# Altium project edison_breakout.PrjPcb
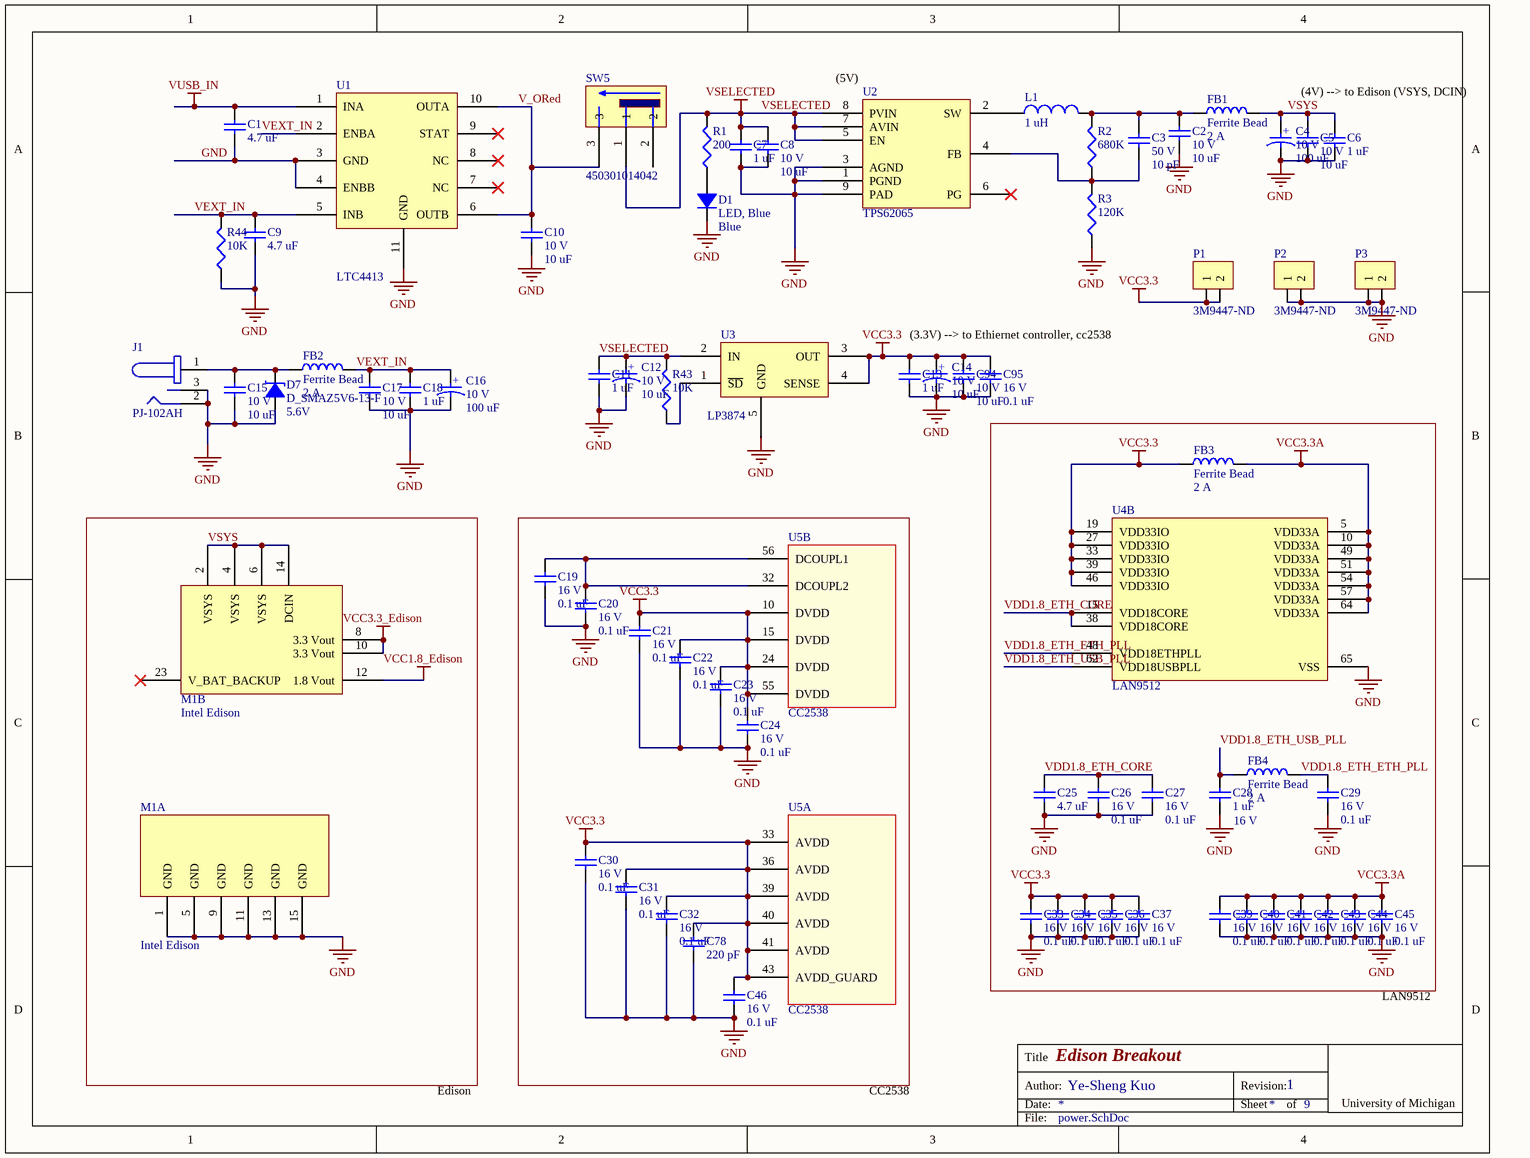
[diagram p0: power.SchDoc]
6 sheets, 162 parts. Net scope: flat (ports and power ports of the same name join across sheets).
Board files: edison_breakout3.PcbDoc, edison_breakoutarray.PcbDoc
Sheets:
  power.SchDoc
  cc2538.SchDoc
  ethernet.SchDoc
  usb_host_slave.SchDoc
  cc2520_cc2592.SchDoc
  edison_misc.SchDoc

## Sheet power.SchDoc: Edison Breakout
size Letter; Author: Ye-Sheng Kuo; Revision: 1; SheetTotal: 9

### Parts
C1  value 4.7 uF  [0603]  (hidden comment: Ceramic capacitor)
C2  value 10 uF  voltage rated: 10 V  [0603]  (hidden comment: Ceramic capacitor)
C3  value 10 pF  voltage rated: 50 V  [0402]  (hidden comment: Ceramic capacitor)
C4  value 100 uF  voltage rated: 10 V  [1206 - POLAR MARKING]  (hidden comment: Tantalum capacitor)
C5  value 10 uF  voltage rated: 10 V  [0603]  (hidden comment: Ceramic capacitor)
C6  value 1 uF  [0402]  (hidden comment: Ceramic capacitor)
C7  value 1 uF  [0402]  (hidden comment: Ceramic capacitor)
C8  value 10 uF  voltage rated: 10 V  [0603]  (hidden comment: Ceramic capacitor)
C9  value 4.7 uF  [0603]  (hidden comment: Ceramic capacitor)
C10  value 10 uF  voltage rated: 10 V  [0603]  (hidden comment: Ceramic capacitor)
C11  value 1 uF  [0402]  (hidden comment: Ceramic capacitor)
C12  value 10 uF  voltage rated: 10 V  [0603 - Polar Marking]  (hidden comment: Tantalum capacitor)
C13  value 1 uF  [0402]  (hidden comment: Ceramic capacitor)
C14  value 10 uF  voltage rated: 10 V  [0603 - Polar Marking]  (hidden comment: Tantalum capacitor)
C15  value 10 uF  voltage rated: 10 V  [0603]  (hidden comment: Ceramic capacitor)
C16  value 100 uF  voltage rated: 10 V  [1206 - POLAR MARKING]  (hidden comment: Tantalum capacitor)
C17  value 10 uF  voltage rated: 10 V  [0603]  (hidden comment: Ceramic capacitor)
C18  value 1 uF  [0402]  (hidden comment: Ceramic capacitor)
C19  value 0.1 uF  voltage rated: 16 V  [0402]  (hidden comment: Ceramic capacitor)
C20  value 0.1 uF  voltage rated: 16 V  [0402]  (hidden comment: Ceramic capacitor)
C21  value 0.1 uF  voltage rated: 16 V  [0402]  (hidden comment: Ceramic capacitor)
C22  value 0.1 uF  voltage rated: 16 V  [0402]  (hidden comment: Ceramic capacitor)
C23  value 0.1 uF  voltage rated: 16 V  [0402]  (hidden comment: Ceramic capacitor)
C24  value 0.1 uF  voltage rated: 16 V  [0402]  (hidden comment: Ceramic capacitor)
C25  value 4.7 uF  [0603]  (hidden comment: Ceramic capacitor)
C26  value 0.1 uF  voltage rated: 16 V  [0402]  (hidden comment: Ceramic capacitor)
C27  value 0.1 uF  voltage rated: 16 V  [0402]  (hidden comment: Ceramic capacitor)
C28  value 1 uF  voltage rated: 16 V  [0402]  (hidden comment: Ceramic capacitor)
C29  value 0.1 uF  voltage rated: 16 V  [0402]  (hidden comment: Ceramic capacitor)
C30  value 0.1 uF  voltage rated: 16 V  [0402]  (hidden comment: Ceramic capacitor)
C31  value 0.1 uF  voltage rated: 16 V  [0402]  (hidden comment: Ceramic capacitor)
C32  value 0.1 uF  voltage rated: 16 V  [0402]  (hidden comment: Ceramic capacitor)
C33  value 0.1 uF  voltage rated: 16 V  [0402]  (hidden comment: Ceramic capacitor)
C34  value 0.1 uF  voltage rated: 16 V  [0402]  (hidden comment: Ceramic capacitor)
C35  value 0.1 uF  voltage rated: 16 V  [0402]  (hidden comment: Ceramic capacitor)
C36  value 0.1 uF  voltage rated: 16 V  [0402]  (hidden comment: Ceramic capacitor)
C37  value 0.1 uF  voltage rated: 16 V  [0402]  (hidden comment: Ceramic capacitor)
C39  value 0.1 uF  voltage rated: 16 V  [0402]  (hidden comment: Ceramic capacitor)
C40  value 0.1 uF  voltage rated: 16 V  [0402]  (hidden comment: Ceramic capacitor)
C41  value 0.1 uF  voltage rated: 16 V  [0402]  (hidden comment: Ceramic capacitor)
C42  value 0.1 uF  voltage rated: 16 V  [0402]  (hidden comment: Ceramic capacitor)
C43  value 0.1 uF  voltage rated: 16 V  [0402]  (hidden comment: Ceramic capacitor)
C44  value 0.1 uF  voltage rated: 16 V  [0402]  (hidden comment: Ceramic capacitor)
C45  value 0.1 uF  voltage rated: 16 V  [0402]  (hidden comment: Ceramic capacitor)
C46  value 0.1 uF  voltage rated: 16 V  [0402]  (hidden comment: Ceramic capacitor)
C78  value 220 pF  [0402]  (hidden comment: Ceramic capacitor)
C94  value 10 uF  voltage rated: 10 V  [0603]  (hidden comment: Ceramic capacitor)
C95  value 0.1 uF  voltage rated: 16 V  [0402]  (hidden comment: Ceramic capacitor)
D1  LED, Blue  Color: Blue  [0402 - DIODE]
D7  D_SMAZ5V6-13-F  Zf: 5.6V  [SMAZ5V1]
FB1  Ferrite Bead  current rating: 2 A  [0603]
FB2  Ferrite Bead  current rating: 2 A  [0603]
FB3  Ferrite Bead  current rating: 2 A  [0603]
FB4  Ferrite Bead  current rating: 2 A  [0603]
J1  PJ-102AH  [PJ-102AH]
L1  value 1 uH  [1210]  (hidden comment: Chip inductor)
M1  Intel Edison  [Intel Edison mating]  (parts A,B of 5)
P1  Supplier Part Number 1: 3M9447-ND  [1x2 header]  (hidden comment: 1 x 2 header)
P2  Supplier Part Number 1: 3M9447-ND  [1x2 header]  (hidden comment: 1 x 2 header)
P3  Supplier Part Number 1: 3M9447-ND  [1x2 header]  (hidden comment: 1 x 2 header)
R1  value 200  [0402]  (hidden comment: Chip resistor)
R2  value 680K  [0402]  (hidden comment: Chip resistor)
R3  value 120K  [0402]  (hidden comment: Chip resistor)
R43  value 10K  [0402]  (hidden comment: Chip resistor)
R44  value 10K  [0402]  (hidden comment: Chip resistor)
SW5  450301014042  [450301014042]
U1  LTC4413  [DFN-10]
U2  TPS62065  [PWSON-8]
U3  LP3874  [SOT150P700X180-5N]
U4  LAN9512  [QFN-64]  (part B of 5)
U5  CC2538  [QFN56]  (parts A,B of 6)

### Nets
GND: C1.2 C2.2 C4.2 C5.2 C6.2 C7.2 C8.2 C9.2 C10.2 C11.2 C12.2 C13.2 C14.2 C15.2 C16.2 C17.2 C18.2 C19.2 C20.2 C21.2 C22.2 C23.2 C24.2 C25.2 C26.2 C27.2 C28.2 C29.2 C30.2 C31.2 C32.2 C33.2 C34.2 C35.2 C36.2 C37.2 C39.2 C40.2 C41.2 C42.2 C43.2 C44.2 C45.2 C46.2 C78.2 C94.2 C95.2 D1.2 D7.1 J1.2 J1.3 M1.1(GND) M1.5(GND) M1.9(GND) M1.11(GND) M1.13(GND) M1.15(GND) P2.1 P2.2 P3.1 P3.2 R3.2 R44.2 U1.3(GND) U1.4(ENBB) U1.11(GND) U2.1(PGND) U2.3(AGND) U2.9(PAD) U3.5(GND) U4.65(VSS)
VCC1.8_Edison: M1.12(1.8_Vout)
VCC3.3: C13.1 C14.1 C21.1 C22.1 C23.1 C24.1 C30.1 C31.1 C32.1 C33.1 C34.1 C35.1 C36.1 C37.1 C46.1 C78.1 C94.1 C95.1 FB3.2 P1.1 P1.2 U3.3(OUT) U3.4(SENSE) U4.19(VDD33IO) U4.27(VDD33IO) U4.33(VDD33IO) U4.39(VDD33IO) U4.46(VDD33IO) U5.10(DVDD) U5.15(DVDD) U5.24(DVDD) U5.33(AVDD) U5.36(AVDD) U5.39(AVDD) U5.40(AVDD) U5.41(AVDD) U5.43(AVDD_GUARD) U5.55(DVDD)
VCC3.3_Edison: M1.8(3.3_Vout) M1.10(3.3_Vout)
VCC3.3A: C39.1 C40.1 C41.1 C42.1 C43.1 C44.1 C45.1 FB3.1 U4.5(VDD33A) U4.10(VDD33A) U4.49(VDD33A) U4.51(VDD33A) U4.54(VDD33A) U4.57(VDD33A) U4.64(VDD33A)
VSELECTED: C7.1 C8.1 C11.1 C12.1 R1.1 R43.1 SW5.1 U2.5(EN) U2.7(AVIN) U2.8(PVIN) U3.2(IN)
VUSB_IN: C1.1 U1.1(INA)
V_ORed: C10.1 SW5.3 U1.6(OUTB) U1.10(OUTA)
VDD1.8_ETH_CORE: C25.1 C26.1 C27.1 U4.15(VDD18CORE) U4.38(VDD18CORE)
VDD1.8_ETH_ETH_PLL: C29.1 FB4.1 U4.48(VDD18ETHPLL)
VDD1.8_ETH_USB_PLL: C28.1 FB4.2 U4.62(VDD18USBPLL)
VEXT_IN: C9.1 C16.1 C17.1 C18.1 FB2.1 R44.1 U1.2(ENBA) U1.5(INB)
VSYS: C4.1 C5.1 C6.1 FB1.1 M1.2(VSYS) M1.4(VSYS) M1.6(VSYS) M1.14(DCIN)
NetC2_1: C2.1 C3.1 FB1.2 L1.1 R2.1
NetC3_2: C3.2 R2.2 R3.1 U2.4(FB)
NetC15_1: C15.1 D7.2 FB2.2 J1.1
NetC19_1: C19.1 C20.1 U5.32(DCOUPL2) U5.56(DCOUPL1)
NetD1_1: D1.1 R1.2
NetL1_2: L1.2 U2.2(SW)
NetR43_2: R43.2 U3.1(~{SD})

Not connected (* = marked no-connect by the designer): M1 23(V_BAT_BACKUP)*; SW5 2; U1 7(NC)* 8(NC)* 9(STAT)*; U2 6(PG)*

### Notes on the sheet
- (near U2) (5V)
- (4V) --> to Edison (VSYS, DCIN)
- (3.3V) --> to Ethiernet controller, cc2538
- LAN9512
- Edison
- CC2538
- Title
- Date:
- Author:
- Revision:
- Sheet
- of
- University of Michigan
- File:
- (in symbol C_10u_10V_0603_tantalum) +
- (in symbol C_100u_10V_1206_tantalum) +

### Library data of the parts
C1 C9 C25 = C_4.7u_10V_0603_ceramic: Ceramic capacitor, 4.7u, 10V, 0603 package; Manufacture: TDK; tolerance: 20%; Temp rating: X5R; package: 0603; voltage rated: 10 V; Supplier 1: Digi-Key; Supplier Part Number 1: 445-7482-1-ND
C2 C5 C8 C10 C15 C17 C94 = C_10u_10V_0603_ceramic: Ceramic capacitor, 10 uF, 10 V, 0603 package; Manufacture: Murata; tolerance: 20%; Temperature Coefficient: X5R; package: 0603; Supplier 1: Digi-Key; Supplier Part Number 1: 490-7197-1-ND
C3 = C_10p_50V_0402_ceramic: Ceramic capacitor, 10 pF, 16 V, 0402 package; Manufacture: Murata; tolerance: 1%; Temperature Coefficient: C0G; package: 0402; Supplier 1: Digi-Key; Supplier Part Number 1: 490-6186-1-ND
C4 C16 = C_100u_10V_1206_tantalum: Tantalum capacitor, 100 uF, 10 V, 1206 package; Manufacture: AVX; tolerance: 20%; package: 1206; Supplier 1: Digi-Key; Supplier Part Number 1: 478-6251-1-ND
C6 C7 C11 C13 C18 C28 = C_1u_16V_0402_ceramic: Ceramic capacitor, 1 uF, 16V, 0402 package; Manufacture: TDK; tolerance: 10%; Temperature rating: X5R; package: 0402; Supplier 1: Digi-Key; Supplier Part Number 1: 445-4978-1-ND
  C6 C7 C11 C13 C18: voltage rated: 16 V
C12 C14 = C_10u_10V_0603_tantalum: Tantalum capacitor, 10 uF, 10 V, 0603 package; Manufacture: Rohm Semiconductor; tolerance: 10%; ESR: 9 Ω; package: 0603; Supplier 1: Digi-Key; Supplier Part Number 1: 511-1679-1-ND
C19-C24 C26 C27 C29-C37 C39-C46 C95 = C_0.1u_16V_0402_ceramic: Ceramic capacitor, 0.1u, 16 V, 0402 package; Manufacture: Murata; tolerance: 10%; Temperature Coef: X7R; package: 0402; Supplier 1: Digi-Key; Supplier Part Number 1: 490-3261-1-ND
C78 = C_220p_50V_0402_ceramic: Ceramic capacitor, 220 pF, 0402 package; Manufacture: Johanson; voltage rated: 50 V; tolerance: 10%; package: 0402; Temperature: X7R; Supplier 1: Digi-Key; Supplier Part Number 1: 445-1254-1-ND
D1 = D_LED_BLUE_0402: LED, Blue, 0402; Forward Voltage: 2.9 V; Current @ VF: 5 mA; package: 0402; Supplier 1: Digi-Key; Supplier Part Number 1: 511-1615-1-ND
D7 = D_SMAZ5V6-13-F: SURFACE MOUNT ZENER DIODE; Supplier 1: Digi-Key; Supplier Part Number 1: SMAZ5V6-FDICT-ND
FB1-FB4 = FB_2A_0603: Ferrite Bead, 2 A, 0603 package; DC resistance: 50 m; package: 0603; Supplier 1: Digi-Key; Supplier Part Number 1: 553-2387-1-ND
J1 = PJ-102AH: CONN PWR JACK 2.1X5.5MM HIGH CUR; Supplier 1: Digi-Key; Supplier Part Number 1: CP-102AH-ND
L1 = L_1u_LQM32PN: Chip inductor, 1 uH, 1210 package, LQM32PN; tolerance: 20%; package: 1210; Supplier 1: Digi-Key; Supplier Part Number 1: 490-10767-1-ND
P1-P3 = 1 x 2 header: 100 mils standard header; Supplier 1: Digi-Key
R1 = R_200_0402: Chip resistor, 200, 0402 package; tolerance: 1%; power: 1/16 W; package: 0402; Supplier 1: Digi-Key; Supplier Part Number 1: 541-200LCT-ND
R2 = R_680K_0402: Chip resistor, 680K, 0402 package; tolerance: 1%; power: 1/16 W; package: 0402; Supplier 1: Digi-Key; Supplier Part Number 1: 541-680KLCT-ND
R3 = R_120K_0402: Chip resistor, 120K, 0402 package; tolerance: 1%; power: 1/16 W; package: 0402; Supplier 1: Digi-Key; Supplier Part Number 1: 541-120KLCT-ND
R43 R44 = R_10K_0402: Chip resistor, 10K, 0402 package; tolerance: 1%; power: 1/16 W; package: 0402; Supplier 1: Digi-Key; Supplier Part Number 1: 541-10.0KLCT-ND
SW5 = 450301014042: Slide switch, SPDT, 500 mA, 12 V; Supplier 1: Digi-Key; Supplier Part Number 1: 450301014042-ND
U1 = LTC4413: Dual 2.6A, 2.5V to 5.5V,  Ideal Diodes in 3mm × 3mm DFN; Supplier 1: Digi-Key; Supplier Part Number 1: LTC4413EDD#TRPBFCT-ND
U2 = TPS62065: 3-MHz, 2-A, Step-Down Converter; Supplier 1: Digi-Key; Supplier Part Number 1: 296-27204-1-ND
U3 = LP3874: LP387x 0.8-A Fast Ultra-Low-Dropout Linear Regulators; Supplier 1: Digi-Key; Supplier Part Number 1: LP3874EMP-3.3/NOPBCT-ND
U4 = LAN9512: USB 2.0 Hub and 10/100  Ethernet Controller; Supplier 1: Digi-Key; Supplier Part Number 1: 638-1086-ND
U5 = CC2538: A Powerful System-On-Chip for 2.4-GHz IEEE 802.15.4, 6LoWPAN  and ZigBee Applications; Supplier 1: Digi-Key; Supplier Part Number 1: 296-35797-1-ND

## Sheet cc2538.SchDoc: Edison Breakout
size Letter; Author: Ye-Sheng Kuo; Revision: 1; SheetTotal: 9
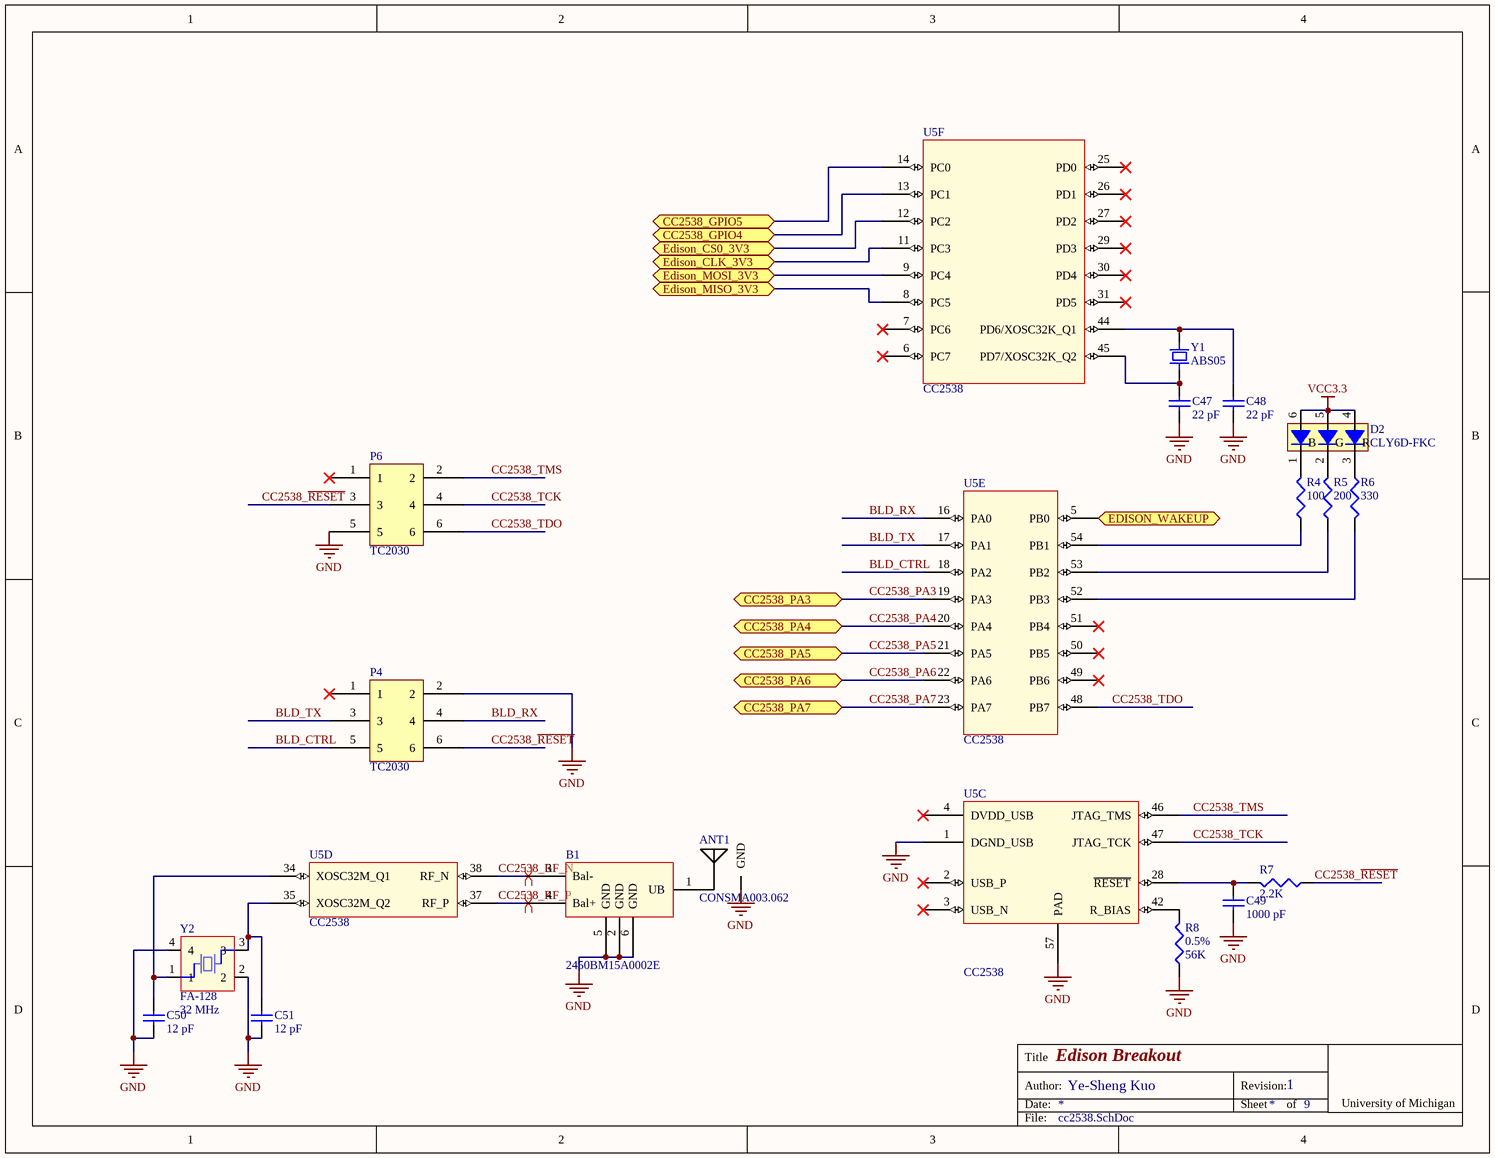
[diagram p1: cc2538.SchDoc]

### Parts
ANT1  CONSMA003.062  [CONSMA003.062]
B1  2450BM15A0002E  [2450BM15A0002]
C47  value 22 pF  [0402]  (hidden comment: Ceramic capacitor)
C48  value 22 pF  [0402]  (hidden comment: Ceramic capacitor)
C49  value 1000 pF  [0402]  (hidden comment: Ceramic capacitor)
C50  value 12 pF  [0402]  (hidden comment: Ceramic capacitor)
C51  value 12 pF  [0402]  (hidden comment: Ceramic capacitor)
D2  CLY6D-FKC  [PLCC6]
P4  TC2030  [TC2030-IDC-NLFP]
P6  TC2030  [TC2030-IDC-NLFP]
R4  value 100  [0402]  (hidden comment: Chip resistor)
R5  value 200  [0402]  (hidden comment: Chip resistor)
R6  value 330  [0402]  (hidden comment: Chip resistor)
R7  value 2.2K  [0402]  (hidden comment: Chip resistor)
R8  value 56K  tolerance: 0.5%  [0402]  (hidden comment: Chip resistor)
U5  CC2538  [QFN56]  (parts C,D,E,F of 6)
Y1  ABS05  [ABS05]
Y2  FA-128  frequency: 32 MHz  [FA-128]

### Ports
CC2538_GPIO4, CC2538_GPIO5, CC2538_PA3, CC2538_PA4, CC2538_PA5, CC2538_PA6, CC2538_PA7, Edison_CLK_3V3, Edison_CS0_3V3, Edison_MISO_3V3, Edison_MOSI_3V3, EDISON_WAKEUP

### Nets
GND: ANT1.1(GND) B1.2(GND) B1.5(GND) B1.6(GND) C47.2 C48.2 C49.2 C50.1 C51.1 P4.2 P6.5 R8.2 U5.1(DGND_USB) U5.57(PAD) Y2.2 Y2.4
VCC3.3: D2.4 D2.5 D2.6
BLD_CTRL: P4.5 U5.18(PA2)
BLD_RX: P4.4 U5.16(PA0)
BLD_TX: P4.3 U5.17(PA1)
CC2538_PA3: U5.19(PA3) ; port CC2538_PA3
CC2538_PA4: U5.20(PA4) ; port CC2538_PA4
CC2538_PA5: U5.21(PA5) ; port CC2538_PA5
CC2538_PA6: U5.22(PA6) ; port CC2538_PA6
CC2538_PA7: U5.23(PA7) ; port CC2538_PA7
CC2538_~{RESET}: P4.6 P6.3 R7.2
CC2538_RF_N: B1.3(Bal-) U5.38(RF_N)
CC2538_RF_P: B1.4(Bal+) U5.37(RF_P)
CC2538_TCK: P6.4 U5.47(JTAG_TCK)
CC2538_TDO: P6.6 U5.48(PB7)
CC2538_TMS: P6.2 U5.46(JTAG_TMS)
NetANT1_2: ANT1.2 B1.1(UB)
NetC47_1: C47.1 U5.45(PD7/XOSC32K_Q2) Y1.2
NetC48_1: C48.1 U5.44(PD6/XOSC32K_Q1) Y1.1
NetC49_1: C49.1 R7.1 U5.28(~{RESET})
NetC50_2: C50.2 U5.34(XOSC32M_Q1) Y2.1
NetC51_2: C51.2 U5.35(XOSC32M_Q2) Y2.3
NetD2_1: D2.1 R4.1
NetD2_2: D2.2 R5.1
NetD2_3: D2.3 R6.2
NetJ7_1: U5.5(PB0) ; port EDISON_WAKEUP
NetR4_2: R4.2 U5.54(PB1)
NetR5_2: R5.2 U5.53(PB2)
NetR6_1: R6.1 U5.52(PB3)
NetR8_1: R8.1 U5.42(R_BIAS)
NetU5_8: U5.8(PC5) ; port Edison_MISO_3V3
NetU5_9: U5.9(PC4) ; port Edison_MOSI_3V3
NetU5_11: U5.11(PC3) ; port Edison_CLK_3V3
NetU5_12: U5.12(PC2) ; port Edison_CS0_3V3
NetU5_13: U5.13(PC1) ; port CC2538_GPIO4
NetU5_14: U5.14(PC0) ; port CC2538_GPIO5

Not connected (* = marked no-connect by the designer): P4 1*; P6 1*; U5 2(USB_P)* 3(USB_N)* 4(DVDD_USB)* 6(PC7)* 7(PC6)* 25(PD0)* 26(PD1)* 27(PD2)* 29(PD3)* 30(PD4)* 31(PD5)* 49(PB6)* 50(PB5)* 51(PB4)*

### Layout directives
differential pair: CC2538_RF_N, CC2538_RF_P

### Notes on the sheet
- Title
- Date:
- Author:
- Revision:
- Sheet
- of
- University of Michigan
- File:
- (in symbol D_CLY6D-FKC) B; G; R

### Library data of the parts
ANT1 = CONSMA003.062: CONN SMA JACK 50 OHM EDGE MNT; Supplier 1: Digi-Key; Supplier Part Number 1: CONSMA003.062-ND
B1 = 2450BM15A0002E: 2.45 GHz Balun for TI CC253X; Supplier 1: Digi-Key; Supplier Part Number 1: 712-1536-1-ND
C47 C48 = C_22p_0402_ceramic: Ceramic capacitor, 22 pF, 0402 package; Manufacture: Johanson; voltage rated: 50 V; tolerance: 2%; package: 0402; Supplier 1: Digi-Key; Supplier Part Number 1: 712-1274-1-ND
C49 = C_1000p_50V_0402_ceramic: Ceramic capacitor, 1000 pF, 0402 package; Manufacture: TDK; voltage rated: 50 V; tolerance: 10%; package: 0402; Supplier 1: Digi-Key; Supplier Part Number 1: 445-6846-1-ND
C50 C51 = C_12p_0402_ceramic: Ceramic capacitor, 12 pF, 0402 package; Manufacture: Johanson; voltage rated: 50 V; tolerance: 2%; package: 0402; Supplier 1: Digi-Key; Supplier Part Number 1: 712-1256-1-ND
D2 = D_CLY6D-FKC: CREE PLCC6 3 in 1 SMD LED; Supplier 1: Digi-Key; Supplier Part Number 1: CLY6D-FKC-CK1N1D1BB7D3D3CT-ND
P4 P6 = TC2030: TC2030-MCP-NL
R4 = R_100_0402: Chip resistor, 100, 0402 package; tolerance: 1%; power: 1/16 W; package: 0402; Supplier 1: Digi-Key; Supplier Part Number 1: 541-100LCT-ND
R5 = R_200_0402: as R1 on sheet power; package: 0402; Supplier 1: Digi-Key; Supplier Part Number 1: 541-200LCT-ND
R6 = R_330_0402: Chip resistor, 330, 0402 package; tolerance: 1%; power: 1/16 W; package: 0402; Supplier 1: Digi-Key; Supplier Part Number 1: 541-330LCT-ND
R7 = R_2.2K_0402: Chip resistor, 2.2K, 0402 package; tolerance: 1%; power: 1/16 W; package: 0402; Supplier 1: Digi-Key; Supplier Part Number 1: 541-2.20KLCT-ND
R8 = R_56K_0402: Chip resistor, 56K, 0402 package; power: 1/16 W; Temperature coefficient: 25 ppm/C; package: 0402; Supplier 1: Digi-Key; Supplier Part Number 1: P56KDECT-ND
U5 = CC2538: as U5 on sheet power; Supplier 1: Digi-Key; Supplier Part Number 1: 296-35797-1-ND
Y1 = ABS05: 32768 Hz SMD Low profile crystal; Supplier 1: Digi-Key; Supplier Part Number 1: 535-11899-1-ND
Y2 = FA-128: MHz Range Crystal Unit; Load capatance: 10 pF; ESR: 60; stability: 20 ppm; Supplier 1: Digi-Key; Supplier Part Number 1: SER3800CT-ND

## Sheet ethernet.SchDoc: Edison Breakout
size Letter; Author: Ye-Sheng Kuo; Revision: 1; SheetTotal: 9
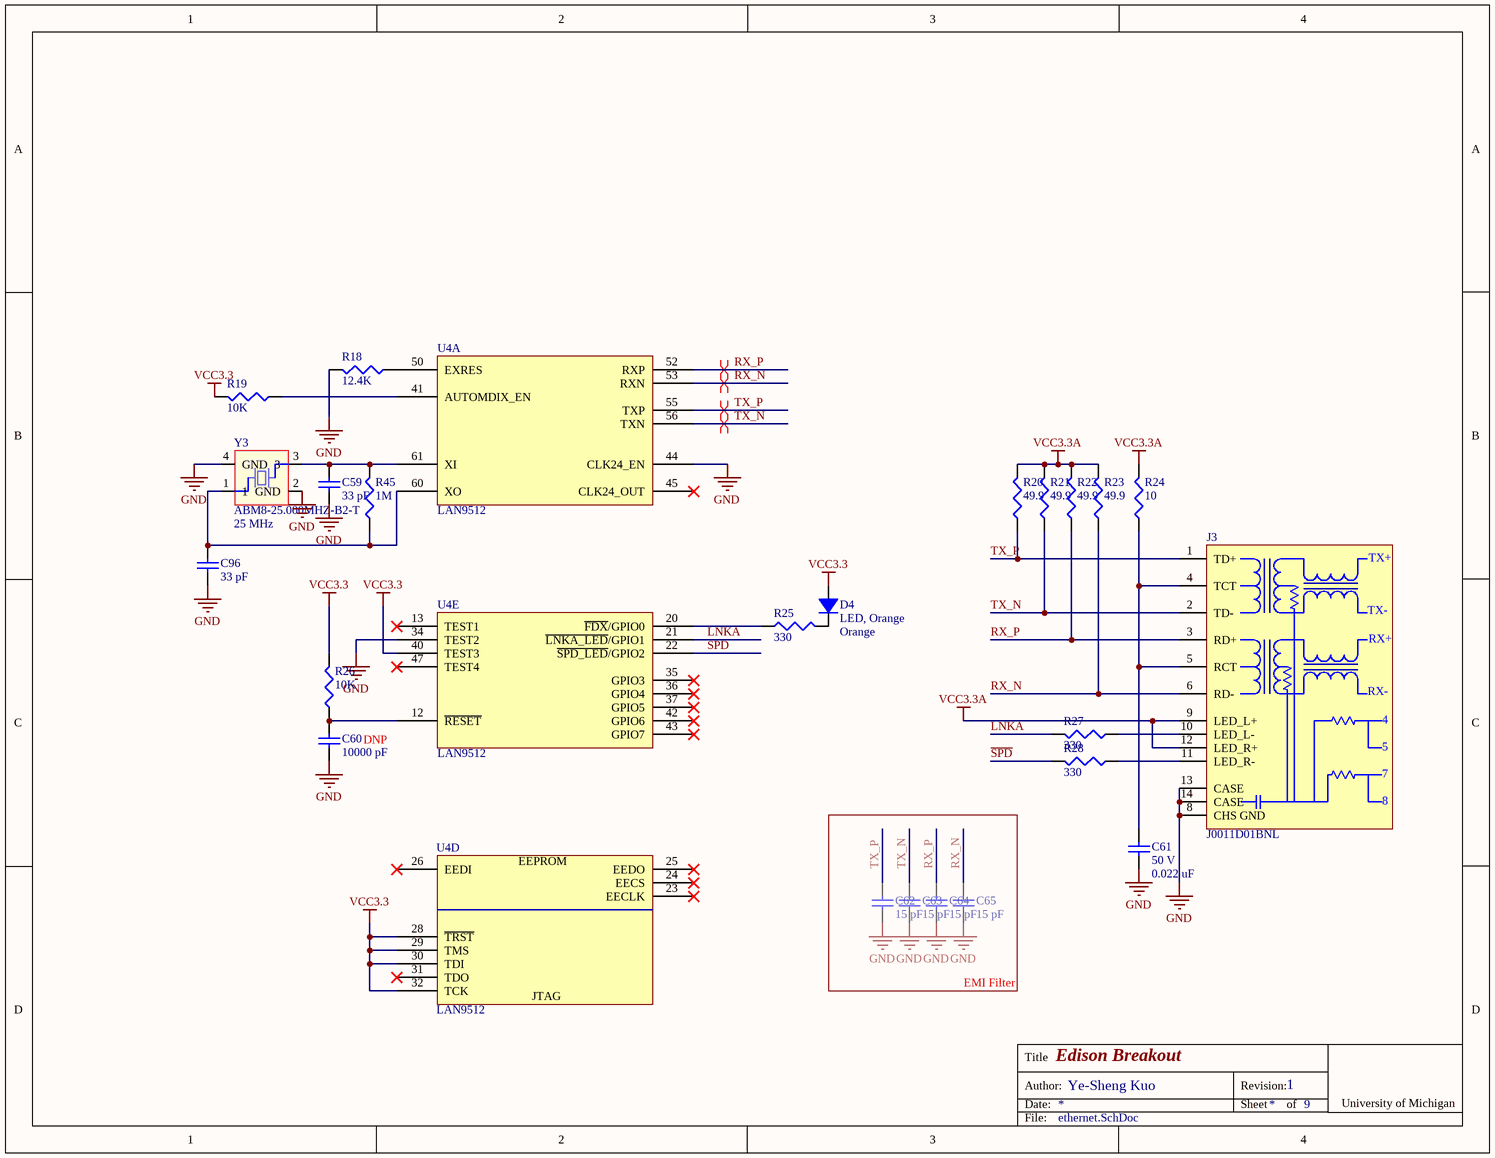
[diagram p2: ethernet.SchDoc]

### Parts
C59  value 33 pF  [0402]  (hidden comment: Ceramic capacitor)
C60  value 10000 pF  [0402]  (hidden comment: Ceramic capacitor)
C61  value 0.022 uF  voltage rated: 50 V  [0402]  (hidden comment: Ceramic capacitor)
C62  value 15 pF  [0402]  (hidden comment: Ceramic capacitor)
C63  value 15 pF  [0402]  (hidden comment: Ceramic capacitor)
C64  value 15 pF  [0402]  (hidden comment: Ceramic capacitor)
C65  value 15 pF  [0402]  (hidden comment: Ceramic capacitor)
C96  value 33 pF  [0402]  (hidden comment: Ceramic capacitor)
D4  LED, Orange  Color: Orange  [0402 - DIODE]
J3  J0011D01BNL  [J0011D01BNL]
R18  value 12.4K  [0402]  (hidden comment: Chip resistor)
R19  value 10K  [0402]  (hidden comment: Chip resistor)
R20  value 49.9  [0402]  (hidden comment: Chip resistor)
R21  value 49.9  [0402]  (hidden comment: Chip resistor)
R22  value 49.9  [0402]  (hidden comment: Chip resistor)
R23  value 49.9  [0402]  (hidden comment: Chip resistor)
R24  value 10  [0402]  (hidden comment: Chip resistor)
R25  value 330  [0402]  (hidden comment: Chip resistor)
R26  value 10K  [0402]  (hidden comment: Chip resistor)
R27  value 330  [0402]  (hidden comment: Chip resistor)
R28  value 330  [0402]  (hidden comment: Chip resistor)
R45  value 1M  [0402]  (hidden comment: Chip resistor)
U4  LAN9512  [QFN-64]  (parts A,D,E of 5)
Y3  ABM8-25.000MHZ-B2-T  Frequency: 25 MHz  [ABM8]

### Blocks framed on the sheet
EMI Filter: C62-C65

### Nets
GND: C59.2 C60.2 C61.2 C62.2 C63.2 C64.2 C65.2 C96.2 J3.8(CHS_GND) J3.13(CASE) J3.14(CASE) R18.1 U4.34(TEST2) U4.44(CLK24_EN) Y3.2(GND) Y3.4(GND)
VCC3.3: D4.1 R19.1 R26.1 U4.28(~{TRST}) U4.29(TMS) U4.30(TDI) U4.32(TCK) U4.40(TEST3)
VCC3.3A: J3.9(LED_L+) J3.12(LED_R+) R20.1 R21.1 R22.1 R23.1 R24.1
~{LNKA}: R27.1 U4.21(~{LNKA_LED}/GPIO1)
RX_N: C65.1 J3.6(RD-) R23.2 U4.53(RXN)
RX_P: C64.1 J3.3(RD+) R22.2 U4.52(RXP)
~{SPD}: R28.1 U4.22(~{SPD_LED}/GPIO2)
TX_N: C63.1 J3.2(TD-) R21.2 U4.56(TXN)
TX_P: C62.1 J3.1(TD+) R20.2 U4.55(TXP)
NetC59_1: C59.1 R45.1 U4.61(XI) Y3.3
NetC60_1: C60.1 R26.2 U4.12(~{RESET})
NetC61_1: C61.1 J3.4(TCT) J3.5(RCT) R24.2
NetC96_1: C96.1 R45.2 U4.60(XO) Y3.1
NetD4_2: D4.2 R25.1
NetJ3_10: J3.10(LED_L-) R27.2
NetJ3_11: J3.11(LED_R-) R28.2
NetR18_2: R18.2 U4.50(EXRES)
NetR19_2: R19.2 U4.41(AUTOMDIX_EN)
NetR25_2: R25.2 U4.20(~{FDX}/GPIO0)

Not connected (* = marked no-connect by the designer): U4 13(TEST1)* 23(EECLK)* 24(EECS)* 25(EEDO)* 26(EEDI)* 31(TDO)* 35(GPIO3)* 36(GPIO4)* 37(GPIO5)* 42(GPIO6)* 43(GPIO7)* 45(CLK24_OUT)* 47(TEST4)*

### Layout directives
differential pair: RX_N, RX_P, TX_N, TX_P

### Notes on the sheet
- DNP
- Title
- Date:
- Author:
- Revision:
- Sheet
- of
- University of Michigan
- File:
- (in symbol J0011D01BNL) TX+; TX-; RX+; RX-; 7
- (in symbol LAN9512, part D) EEPROM; JTAG

### Library data of the parts
C59 C96 = C_33p_0402_ceramic: Ceramic capacitor, 33 pF, 0402 package; Manufacture: Murata; voltage rated: 50 V; tolerance: 5%; package: 0402; Supplier 1: Digi-Key; Supplier Part Number 1: 490-5936-1-ND
C60 = C_10000p_16V_0402_ceramic: Ceramic capacitor, 10000 pF, 16 V, 0402 package; Manufacture: Murata; voltage rated: 16 V; tolerance: 10%; Temperature Coefficient: X7R; package: 0402; Supplier 1: Digi-Key; Supplier Part Number 1: 490-1313-1-ND
C61 = C_0.022u_50V_0402_ceramic: Ceramic capacitor, 0.022 uF, 0402 package; Manufacture: Murata; tolerance: 10%; Temperature Coefficient: X7R; package: 0402; Supplier 1: Digi-Key; Supplier Part Number 1: 490-3884-1-ND
C62-C65 = C_15p_25V_0402_ceramic: Ceramic capacitor, 15 pF, 25V, 0402 package; Manufacture: Murata; tolerance: 5%; voltage rated: 25 V; package: 0402; Supplier 1: Digi-Key; Supplier Part Number 1: 490-8171-1-ND
D4 = D_LED_ORANGE_0402: LED, Orange, 0402; Supplier 1: Digi-Key; Supplier Part Number 1: 511-1590-1-ND; package: 0402
J3 = J0011D01BNL: 1x1 Tab-Down RJ45; Supplier 1: Digi-Key; Supplier Part Number 1: 553-1483-ND
R18 = R_12.4K_0402: Chip resistor, 12.4K, 0402 package; tolerance: 1%; power: 1/16 W; package: 0402; Supplier 1: Digi-Key; Supplier Part Number 1: 311-12.4KLRCT-ND
R19 R26 = R_10K_0402: as R43 on sheet power; package: 0402; Supplier 1: Digi-Key; Supplier Part Number 1: 541-10.0KLCT-ND
R20-R23 = R_49.9_0402: Chip resistor, 49.9, 0402 package; tolerance: 1%; power: 1/16 W; package: 0402; Supplier 1: Digi-Key; Supplier Part Number 1: 541-49.9LCT-ND
R24 = R_10_0402: Chip resistor, 10, 0402 package; tolerance: 1%; power: 1/16 W; package: 0402; Supplier 1: Digi-Key; Supplier Part Number 1: 541-10.0LCT-ND
R25 R27 R28 = R_330_0402: as R6 on sheet cc2538; package: 0402; Supplier 1: Digi-Key; Supplier Part Number 1: 541-330LCT-ND
R45 = R_1M_0402: Chip resistor, 1M, 0402 package; tolerance: 1%; power: 1/16 W; Supplier 1: Digi-Key; Supplier Part Number 1: 541-1.00MLCT-ND; package: 0402
U4 = LAN9512: as U4 on sheet power; Supplier 1: Digi-Key; Supplier Part Number 1: 638-1086-ND
Y3 = ABM8-25.000MHZ-B2-T: Crystal 25.0000MHz 20ppm 18pF 50 Ohm; Frequency stability: 50 ppm; ESR: 50 ohm; Load capacitance: 18 pF; Frequency tolerance: 20 ppm; Supplier 1: Digi-Key; Supplier Part Number 1: 535-9140-1-ND

## Sheet usb_host_slave.SchDoc: Edison Breakout
size Letter; Author: Ye-Sheng Kuo; Revision: 1; SheetTotal: 9
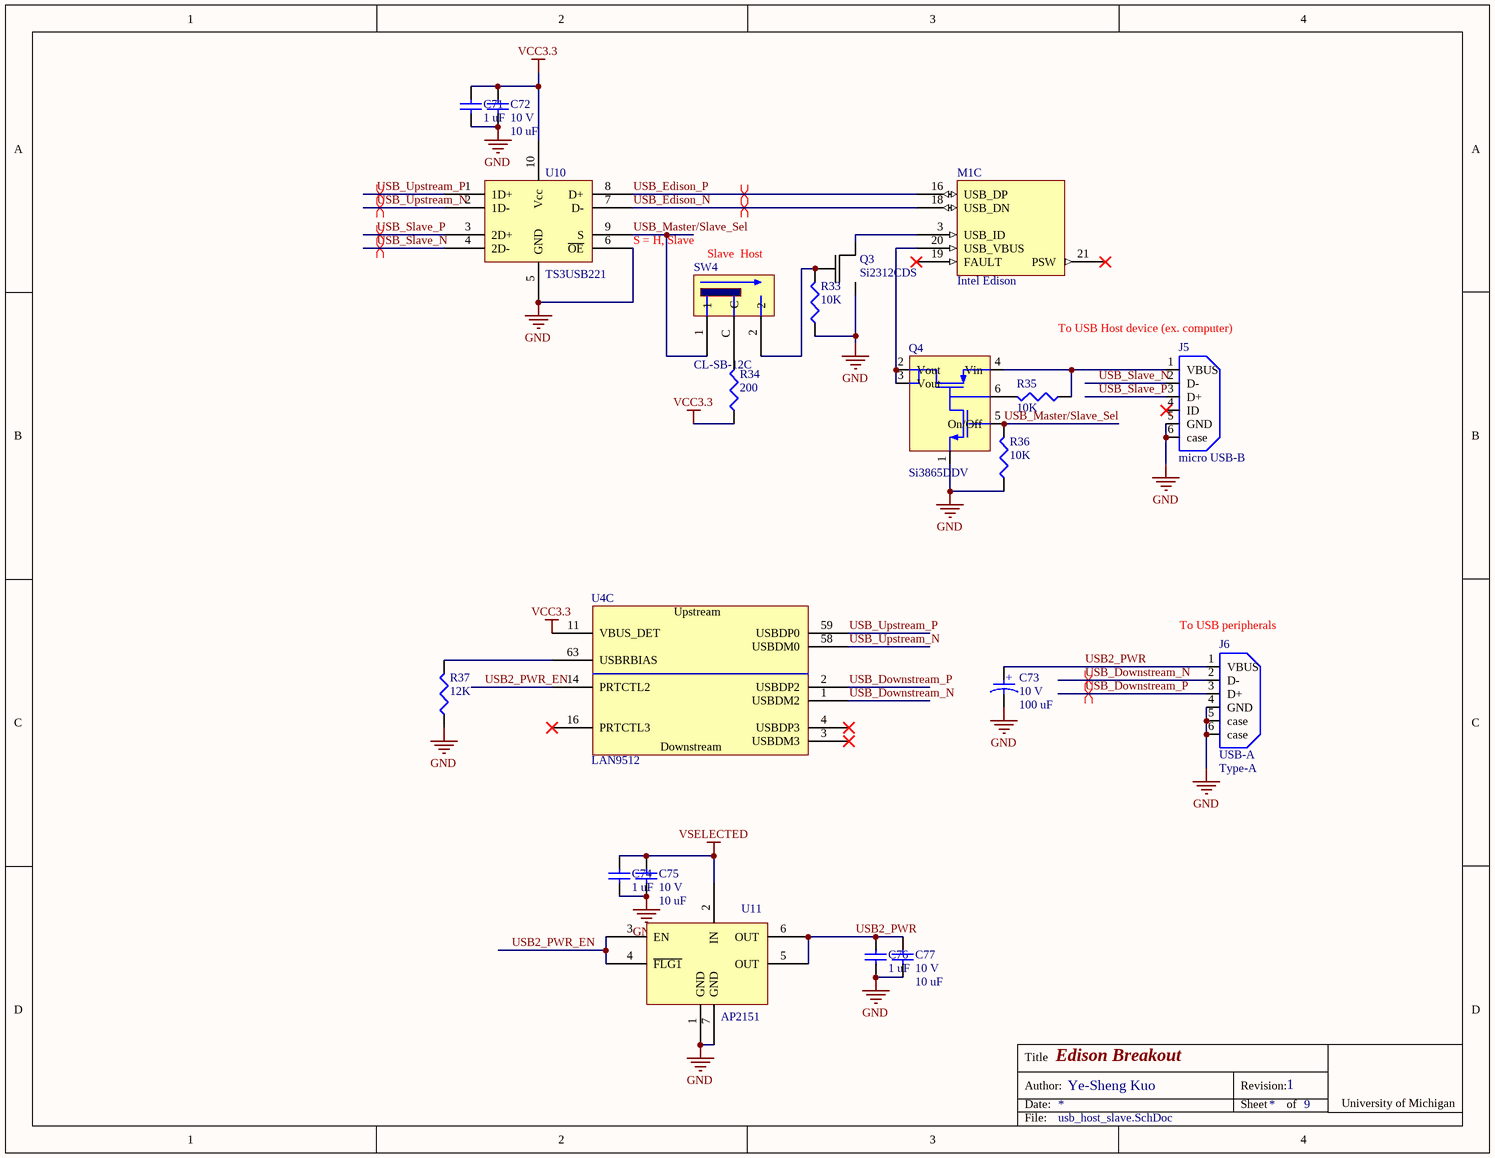
[diagram p3: usb_host_slave.SchDoc]

### Parts
C71  value 1 uF  [0402]  (hidden comment: Ceramic capacitor)
C72  value 10 uF  voltage rated: 10 V  [0603]  (hidden comment: Ceramic capacitor)
C73  value 100 uF  voltage rated: 10 V  [1206 - POLAR MARKING]  (hidden comment: Tantalum capacitor)
C74  value 1 uF  [0402]  (hidden comment: Ceramic capacitor)
C75  value 10 uF  voltage rated: 10 V  [0603]  (hidden comment: Ceramic capacitor)
C76  value 1 uF  [0402]  (hidden comment: Ceramic capacitor)
C77  value 10 uF  voltage rated: 10 V  [0603]  (hidden comment: Ceramic capacitor)
J5  micro USB-B  [Micro USB-B]
J6  USB-A  Type: Type-A  [292303-2]
M1  Intel Edison  [Intel Edison mating]  (part C of 5)
Q3  Si2312CDS  [SOT23-3]
Q4  Si3865DDV  [TSOT-23]
R33  value 10K  [0402]  (hidden comment: Chip resistor)
R34  value 200  [0402]  (hidden comment: Chip resistor)
R35  value 10K  [0402]  (hidden comment: Chip resistor)
R36  value 10K  [0402]  (hidden comment: Chip resistor)
R37  value 12K  [0402]  (hidden comment: Chip resistor)
SW4  CL-SB-12C  [CL-SB-12C]
U4  LAN9512  [QFN-64]  (part C of 5)
U10  TS3USB221  [PUQFN-10]
U11  AP2151  [U-DFN2018-6]

### Nets
GND: C71.2 C72.2 C73.2 C74.2 C75.2 C76.2 C77.2 J5.5(GND) J5.6(case) J6.4(GND) J6.5(case) J6.6(case) Q3.2(S) Q4.1 R33.2 R36.2 R37.2 U10.5(GND) U10.6(~{OE}) U11.1(GND) U11.7(GND)
VCC3.3: C71.1 C72.1 R34.2 U4.11(VBUS_DET) U10.10(Vcc)
VSELECTED: C74.1 C75.1 U11.2(IN)
USB2_PWR: C73.1 C76.1 C77.1 J6.1(VBUS) U11.5(OUT) U11.6(OUT)
USB2_PWR_EN: U4.14(PRTCTL2) U11.3(EN) U11.4(~{FLG1})
USB_Downstream_N: J6.2(D-) U4.1(USBDM2)
USB_Downstream_P: J6.3(D+) U4.2(USBDP2)
USB_Edison_N: M1.18(USB_DN) U10.7(D-)
USB_Edison_P: M1.16(USB_DP) U10.8(D+)
USB_Master/Slave_Sel: Q4.5(On/Off) R36.1 SW4.1 U10.9(S)
USB_Slave_N: J5.2(D-) U10.4(2D-)
USB_Slave_P: J5.3(D+) U10.3(2D+)
USB_Upstream_N: U4.58(USBDM0) U10.2(1D-)
USB_Upstream_P: U4.59(USBDP0) U10.1(1D+)
NetJ5_1: J5.1(VBUS) Q4.4(Vin) R35.2
NetM1_3: M1.3(USB_ID) Q3.3(D)
NetM1_20: M1.20(USB_VBUS) Q4.2(Vout) Q4.3(Vout)
NetQ3_1: Q3.1(G) R33.1 SW4.2
NetQ4_6: Q4.6 R35.1
NetR34_1: R34.1 SW4.C
NetR37_1: R37.1 U4.63(USBRBIAS)

Not connected (* = marked no-connect by the designer): J5 4(ID)*; M1 19(FAULT)* 21(PSW)*; U4 3(USBDM3)* 4(USBDP3)* 16(PRTCTL3)*

### Layout directives
differential pair: USB_Downstream_N, USB_Downstream_P, USB_Edison_N, USB_Edison_P, USB_Slave_N, USB_Slave_P, USB_Upstream_N, USB_Upstream_P

### Notes on the sheet
- (near U10) S = H, Slave
- Slave  Host
- (near J5) To USB Host device (ex. computer)
- (near J6) To USB peripherals
- Title
- Date:
- Author:
- Revision:
- Sheet
- of
- University of Michigan
- File:
- (in symbol C_100u_10V_1206_tantalum) +
- (in symbol LAN9512, part C) Upstream; Downstream

### Library data of the parts
C71 C74 C76 = C_1u_16V_0402_ceramic: as C6 on sheet power; voltage rated: 16 V; package: 0402; Supplier 1: Digi-Key; Supplier Part Number 1: 445-4978-1-ND
C72 C75 C77 = C_10u_10V_0603_ceramic: as C2 on sheet power; package: 0603; Supplier 1: Digi-Key; Supplier Part Number 1: 490-7197-1-ND
C73 = C_100u_10V_1206_tantalum: as C4 on sheet power; package: 1206; Supplier 1: Digi-Key; Supplier Part Number 1: 478-6251-1-ND
J5 = Micro USB: CONN USB MICRO B RECPT SMT R/A; Supplier 1: Digi-Key; Supplier Part Number 1: 609-4616-1-ND
J6 = A105221-ND: USB 2.0 Type A; Supplier 1: Digi-Key; Supplier Part Number 1: A105221-ND
Q3 = Si2312CDS: N-Channel 20 V (D-S) MOSFET; Supplier 1: Digi-Key; Supplier Part Number 1: SI2312CDS-T1-GE3CT-ND
Q4 = Si3865DDV: Load Switch; Supplier 1: Digi-Key; Supplier Part Number 1: SI3865DDV-T1-GE3CT-ND
R33 R35 R36 = R_10K_0402: as R43 on sheet power; package: 0402; Supplier 1: Digi-Key; Supplier Part Number 1: 541-10.0KLCT-ND
R34 = R_200_0402: as R1 on sheet power; package: 0402; Supplier 1: Digi-Key; Supplier Part Number 1: 541-200LCT-ND
R37 = R_12K_0402: Chip resistor, 12K, 0402 package; tolerance: 1%; power: 1/16 W; package: 0402; Supplier 1: Digi-Key; Supplier Part Number 1: 541-12.0KLCT-ND
SW4 = CL-SB-12C: SPST Slide switch; Supplier 1: Digi-Key; Supplier Part Number 1: 563-1322-ND
U4 = LAN9512: as U4 on sheet power; Supplier 1: Digi-Key; Supplier Part Number 1: 638-1086-ND
U10 = TS3USB221: High-Speed USB 2.0 (480-Mbps) 1:2 Multiplexer – Demultiplexer  Switch With Single Enable; Supplier 1: Digi-Key; Supplier Part Number 1: 296-24019-1-ND
U11 = AP2151: 0.5A SINGLE CHANNEL CURRENT-LIMITED  POWER SWITCH WITH OUTPUT DISCHARGE; Supplier 1: Digi-Key; Supplier Part Number 1: AP2151FMG-7DICT-ND

## Sheet cc2520_cc2592.SchDoc: Edison Breakout
size Letter; Author: Ye-Sheng Kuo; Revision: 1; SheetTotal: 9
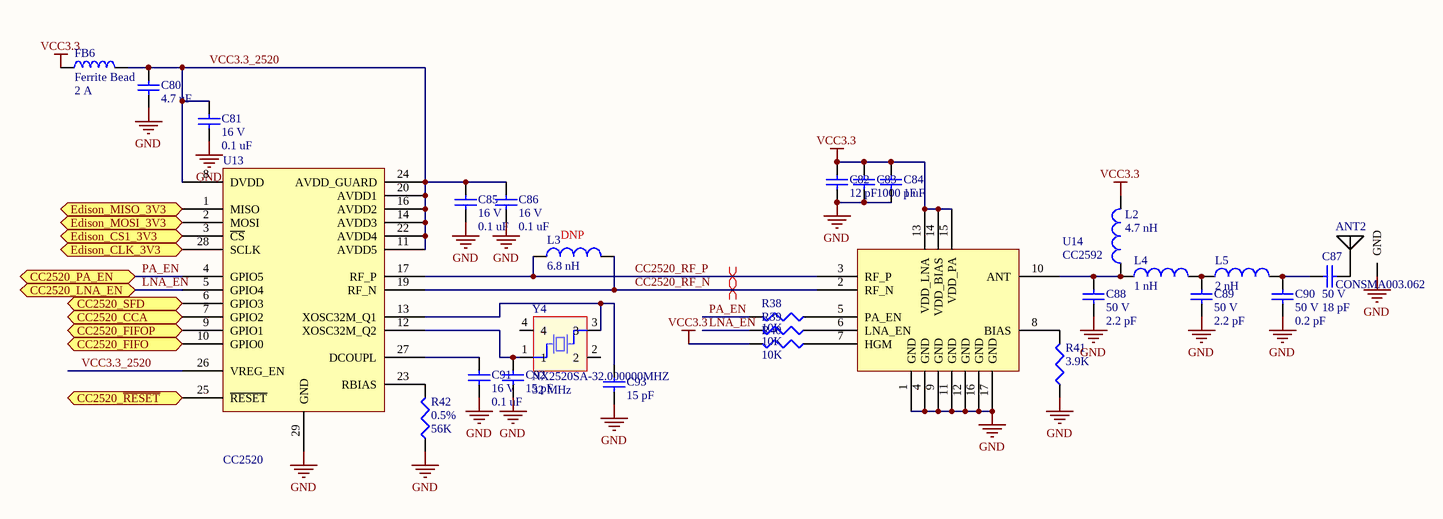
[diagram p4: cc2520_cc2592.SchDoc]

### Parts
ANT2  CONSMA003.062  [CONSMA003.062]
C80  value 4.7 uF  [0603]  (hidden comment: Ceramic capacitor)
C81  value 0.1 uF  voltage rated: 16 V  [0402]  (hidden comment: Ceramic capacitor)
C82  value 12 pF  [0402]  (hidden comment: Ceramic capacitor)
C83  value 1000 pF  [0402]  (hidden comment: Ceramic capacitor)
C84  value 1 uF  [0402]  (hidden comment: Ceramic capacitor)
C85  value 0.1 uF  voltage rated: 16 V  [0402]  (hidden comment: Ceramic capacitor)
C86  value 0.1 uF  voltage rated: 16 V  [0402]  (hidden comment: Ceramic capacitor)
C87  value 18 pF  voltage rated: 50 V  [0402]  (hidden comment: Ceramic capacitor)
C88  value 2.2 pF  voltage rated: 50 V  [0402]  (hidden comment: Ceramic capacitor)
C89  value 2.2 pF  voltage rated: 50 V  [0402]  (hidden comment: Ceramic capacitor)
C90  value 0.2 pF  voltage rated: 50 V  [0402]  (hidden comment: Ceramic capacitor)
C91  value 0.1 uF  voltage rated: 16 V  [0402]  (hidden comment: Ceramic capacitor)
C92  value 15 pF  [0402]  (hidden comment: Ceramic capacitor)
C93  value 15 pF  [0402]  (hidden comment: Ceramic capacitor)
FB6  Ferrite Bead  current rating: 2 A  [0603]
L2  value 4.7 nH  [0402]  (hidden comment: Chip inductor)
L3  value 6.8 nH  [0402]  (hidden comment: Chip inductor)
L4  value 1 nH  [0402]  (hidden comment: Chip inductor)
L5  value 2 nH  [0402]  (hidden comment: Chip inductor)
R38  value 10K  [0402]  (hidden comment: Chip resistor)
R39  value 10K  [0402]  (hidden comment: Chip resistor)
R40  value 10K  [0402]  (hidden comment: Chip resistor)
R41  value 3.9K  [0402]  (hidden comment: Chip resistor)
R42  value 56K  tolerance: 0.5%  [0402]  (hidden comment: Chip resistor)
U13  CC2520  [QFN-28]
U14  CC2592  [QFN-16]
Y4  NX2520SA-32.000000MHZ  Frequency: 32 MHz  [NX2520SA]

### Ports
CC2520_CCA, CC2520_FIFO, CC2520_FIFOP, CC2520_LNA_EN, CC2520_PA_EN, CC2520_SFD, CC2520_~{RESET}, Edison_CLK_3V3, Edison_CS1_3V3, Edison_MISO_3V3, Edison_MOSI_3V3

### Nets
GND: ANT2.1(GND) C80.2 C81.2 C82.2 C83.2 C84.2 C85.2 C86.2 C88.2 C89.2 C90.2 C91.2 C92.2 C93.2 R41.2 R42.2 U13.29(GND) U14.1(GND) U14.4(GND) U14.9(GND) U14.11(GND) U14.12(GND) U14.16(GND) U14.17(GND)
VCC3.3: C82.1 C83.1 C84.1 FB6.2 L2.1 R40.1 U14.13(VDD_LNA) U14.14(VDD_BIAS) U14.15(VDD_PA)
CC2520_RF_N: L3.1 U13.19(RF_N) U14.2(RF_N)
CC2520_RF_P: L3.2 U13.17(RF_P) U14.3(RF_P)
LNA_EN: R39.1 U13.5(GPIO4) ; port CC2520_LNA_EN
PA_EN: R38.1 U13.4(GPIO5) ; port CC2520_PA_EN
VCC3.3_2520: C80.1 C81.1 C85.1 C86.1 FB6.1 U13.8(DVDD) U13.11(AVDD5) U13.14(AVDD3) U13.16(AVDD2) U13.20(AVDD1) U13.22(AVDD4) U13.24(AVDD_GUARD) U13.26(VREG_EN)
NetANT2_2: ANT2.2 C87.2
NetC87_1: C87.1 C90.1 L5.1
NetC88_1: C88.1 L2.2 L4.2 U14.10(ANT)
NetC89_1: C89.1 L4.1 L5.2
NetC91_1: C91.1 U13.27(DCOUPL)
NetC92_1: C92.1 U13.12(XOSC32M_Q2) Y4.1
NetC93_1: C93.1 U13.13(XOSC32M_Q1) Y4.3
NetR38_2: R38.2 U14.5(PA_EN)
NetR39_2: R39.2 U14.6(LNA_EN)
NetR40_2: R40.2 U14.7(HGM)
NetR41_1: R41.1 U14.8(BIAS)
NetR42_1: R42.1 U13.23(RBIAS)
NetU5_8: U13.1(MISO) ; port Edison_MISO_3V3
NetU5_9: U13.2(MOSI) ; port Edison_MOSI_3V3
NetU5_11: U13.28(SCLK) ; port Edison_CLK_3V3
NetU13_3: U13.3(~{CS}) ; port Edison_CS1_3V3
NetU13_6: U13.6(GPIO3) ; port CC2520_SFD
NetU13_7: U13.7(GPIO2) ; port CC2520_CCA
NetU13_9: U13.9(GPIO1) ; port CC2520_FIFOP
NetU13_10: U13.10(GPIO0) ; port CC2520_FIFO
NetU13_25: U13.25(~{RESET}) ; port CC2520_~{RESET}

Not connected (* = marked no-connect by the designer): Y4 2 4

### Layout directives
differential pair: CC2520_RF_N, CC2520_RF_P

### Notes on the sheet
- (near L3) DNP
- Title
- Date:
- Author:
- Revision:
- Sheet
- of
- University of Michigan
- File:

### Library data of the parts
ANT2 = CONSMA003.062: CONN SMA JACK 50 OHM EDGE MNT; Supplier 1: Digi-Key; Supplier Part Number 1: CONSMA003.062-ND
C80 = C_4.7u_10V_0603_ceramic: as C1 on sheet power; package: 0603; voltage rated: 10 V; Supplier 1: Digi-Key; Supplier Part Number 1: 445-7482-1-ND
C81 C85 C86 C91 = C_0.1u_16V_0402_ceramic: as C19 on sheet power; package: 0402; Supplier 1: Digi-Key; Supplier Part Number 1: 490-3261-1-ND
C82 = C_12p_0402_ceramic: as C50 on sheet cc2538; package: 0402; Supplier 1: Digi-Key; Supplier Part Number 1: 712-1256-1-ND
C83 = C_1000p_50V_0402_ceramic: as C49 on sheet cc2538; package: 0402; Supplier 1: Digi-Key; Supplier Part Number 1: 445-6846-1-ND
C84 = C_1u_16V_0402_ceramic: as C6 on sheet power; voltage rated: 16 V; package: 0402; Supplier 1: Digi-Key; Supplier Part Number 1: 445-4978-1-ND
C87 = C_18p_50V_0402_ceramic: Ceramic capacitor, 18 pF, 0402 package; Manufacture: Johanson; tolerance: 2%; Temperature Coefficient: C0G; package: 0402; Supplier 1: Digi-Key; Supplier Part Number 1: 712-1264-1-ND
C88 C89 = C_2.2p_50V_0402_ceramic: Ceramic capacitor, 2.2 pF, 0402 package; Manufacture: Johanson; tolerance: 0.1 pF; Temperature Coefficient: C0G; package: 0402; Supplier 1: Digi-Key; Supplier Part Number 1: 712-1279-1-ND
C90 = C_0.2p_50V_0402_ceramic: Ceramic capacitor, 0.2 pF, 0402 package; Manufacture: Johanson; tolerance: 0.05 pF; Temperature Coefficient: C0G; package: 0402; Supplier 1: Digi-Key; Supplier Part Number 1: 712-1244-1-ND
C92 C93 = C_15p_25V_0402_ceramic: as C62 on sheet ethernet; voltage rated: 25 V; package: 0402; Supplier 1: Digi-Key; Supplier Part Number 1: 490-8171-1-ND
FB6 = FB_2A_0603: as FB1 on sheet power; package: 0603; Supplier 1: Digi-Key; Supplier Part Number 1: 553-2387-1-ND
L2 = L_4.7n_300mA_0402: Chip inductor, 4.7 nH, 0402 package, 300 mA; tolerance: 0.3 nH; Current Rating: 300 mA; package: 0402; Supplier 1: Digi-Key; Supplier Part Number 1: 490-2618-1-ND
L3 = L_6.8n_0402: Chip inductor, 6.8 nH, 0402 package; tolerance: 5%; package: 0402; Supplier 1: Digi-Key; Supplier Part Number 1: 712-1419-1-ND
L4 = L_1n_300mA_0402: Chip inductor, 1 nH, 0402 package, 300 mA; tolerance: 0.3 nH; Current Rating: 300 mA; package: 0402; Supplier 1: Digi-Key; Supplier Part Number 1: 490-1073-1-ND
L5 = L_2n_300mA_0402: Chip inductor, 2 nH, 0402 package, 300 mA; tolerance: 0.3 nH; Current Rating: 300 mA; package: 0402; Supplier 1: Digi-Key; Supplier Part Number 1: 490-6558-1-ND
R38-R40 = R_10K_0402: as R43 on sheet power; package: 0402; Supplier 1: Digi-Key; Supplier Part Number 1: 541-10.0KLCT-ND
R41 = R_3.9K_0402: Chip resistor, 3.9K, 0402 package; tolerance: 1%; power: 1/16 W; package: 0402; Supplier 1: Digi-Key; Supplier Part Number 1: 311-3.90KLRCT-ND
R42 = R_56K_0402: as R8 on sheet cc2538; package: 0402; Supplier 1: Digi-Key; Supplier Part Number 1: P56KDECT-ND
U13 = CC2520: 2.4 GHZ IEEE 802.15.4/ZIGBEE® RF TRANSCEIVER; Supplier 1: Digi-Key; Supplier Part Number 1: 296-22996-6-ND
U14 = CC2592: 2.4-GHz Range Extender; Supplier 1: Digi-Key; Supplier Part Number 1: 296-37475-1-ND
Y4 = NX2520SA-32.000000MHZ: Crystal 32.0000MHz 10ppm 10pF 50 Ohm; ESR: 50 ohm; Load capacitance: 10 pF; Frequency stability: 10 ppm; Frequency tolerance: 10 ppm; Supplier 1: Digi-Key; Supplier Part Number 1: 644-1065-1-ND

## Sheet edison_misc.SchDoc: Edison Breakout
size Letter; Author: Ye-Sheng Kuo; Revision: 1; SheetTotal: 9
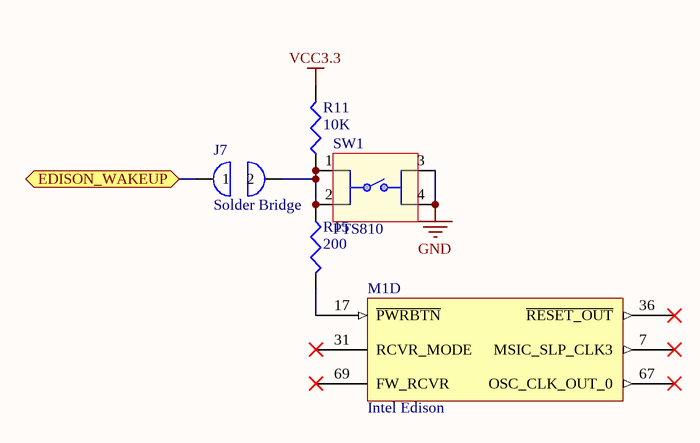
[diagram p5: edison_misc.SchDoc]

### Parts
J7  Solder Bridge  [SolderBridge]
M1  Intel Edison  [Intel Edison mating]  (part D of 5)
R11  value 10K  [0402]  (hidden comment: Chip resistor)
R15  value 200  [0402]  (hidden comment: Chip resistor)
SW1  PTS810  [PTS810]

### Ports
EDISON_WAKEUP

### Nets
GND: SW1.3 SW1.4
VCC3.3: R11.1
NetJ7_1: J7.1 ; port EDISON_WAKEUP
NetJ7_2: J7.2 R11.2 R15.2 SW1.1 SW1.2
NetM1_17: M1.17(~{PWRBTN}) R15.1

Not connected (* = marked no-connect by the designer): M1 7(MSIC_SLP_CLK3)* 31(RCVR_MODE)* 36(~{RESET_OUT})* 67(OSC_CLK_OUT_0)* 69(FW_RCVR)*

### Notes on the sheet
- Title
- Date:
- Author:
- Revision:
- Sheet
- of
- University of Michigan
- File:

### Library data of the parts
J7 = SolderBridge
R11 = R_10K_0402: as R43 on sheet power; package: 0402; Supplier 1: Digi-Key; Supplier Part Number 1: 541-10.0KLCT-ND
R15 = R_200_0402: as R1 on sheet power; package: 0402; Supplier 1: Digi-Key; Supplier Part Number 1: 541-200LCT-ND
SW1 = PTS810: Tactile Switches; Supplier 1: Digi-Key; Supplier Part Number 1: CKN10504CT-ND

## Nets that join several sheets
GND: power (71 pins), cc2538 (16 pins), ethernet (16 pins), usb_host_slave (21 pins), cc2520_cc2592 (24 pins), edison_misc (SW1.3 SW1.4)
VCC3.3: power (38 pins), cc2538 (D2.4 D2.5 D2.6), ethernet (8 pins), usb_host_slave (5 pins), cc2520_cc2592 (9 pins), edison_misc (R11.1)
VCC3.3A: power (15 pins), ethernet (7 pins)
VSELECTED: power (11 pins), usb_host_slave (C74.1 C75.1 U11.2)
NetJ7_1: cc2538 (U5.5), edison_misc (J7.1)
NetU5_8: cc2538 (U5.8), cc2520_cc2592 (U13.1)
NetU5_9: cc2538 (U5.9), cc2520_cc2592 (U13.2)
NetU5_11: cc2538 (U5.11), cc2520_cc2592 (U13.28)